# EasyEDA schematic metoutelete.json
TITLE: Metoutelete; REV: 1.0; Date: 2024-10-17; Sheet: 1/1; Company: Your Company
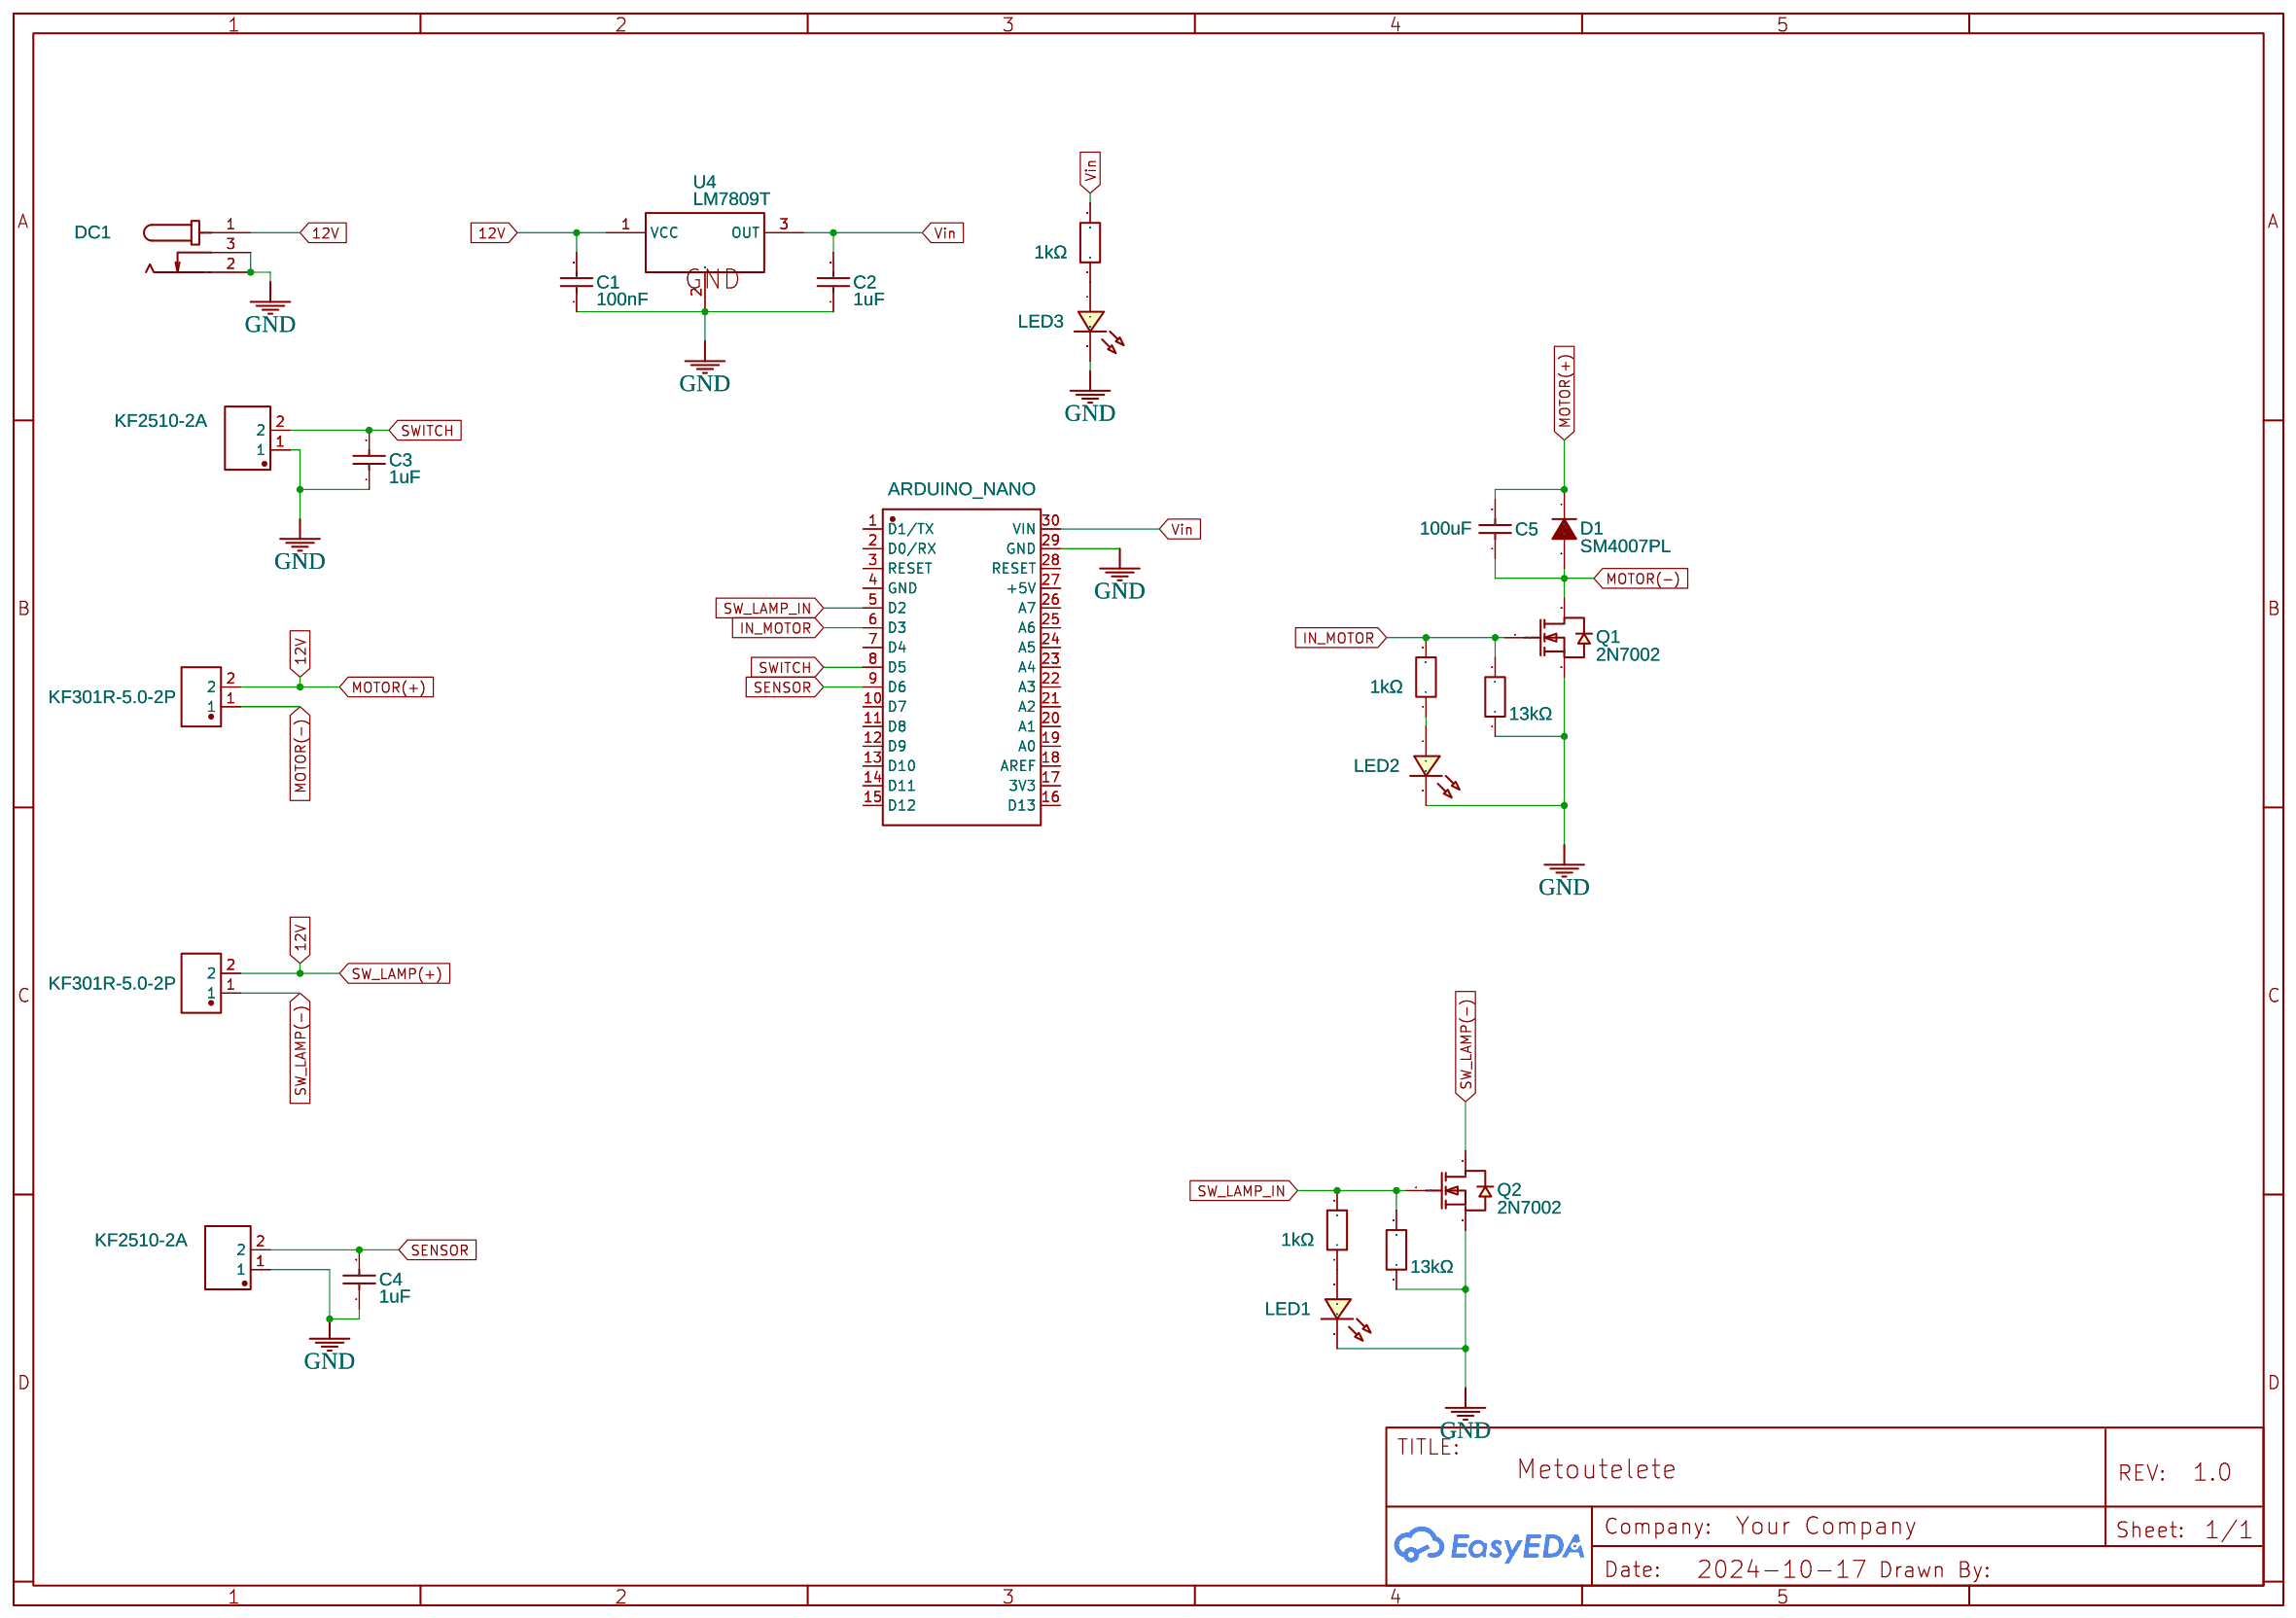
[diagram p0: schematic sheet]

## Parts
C1  100nF  [C0201]
C2  1uF  [C0603]
C3  1uF  [C0603]
C4  1uF  [C0603]
C5  100uF  [C0201]
CN1  KF2510-2A  [CONN-TH_KF2510-2A]
CN2  KF2510-2A  [CONN-TH_KF2510-2A]
D1  SM4007PL  [SOD-123F_L2.8-W1.8-LS3.7-RD]
DC1  DC-005-5A-2.0-SMT  [DC-IN-TH_DC-005-5A-2.0-SMT]
LED1  LED-0603_R  [LED0603_RED]
LED2  LED-0603_R  [LED0603_RED]
LED3  LED-0603_R  [LED0603_RED]
Q1  2N7002  [SOT-23-3_L2.9-W1.3-P1.90-LS2.4-BR]
Q2  2N7002  [SOT-23-3_L2.9-W1.3-P1.90-LS2.4-BR]
U1  ARDUINO_NANO  [COMM-TH_ARDUINO_NANO]
U2  13kΩ  [R0603]
U3  13kΩ  [R0603]
U4  LM7809T  [TO-220-3_L10.0-W4.5-P2.54-L]
U5  KF301R-5.0-2P  [CONN-TH_P5.00_KF301R-5.0-2P]
U6  KF301R-5.0-2P  [CONN-TH_P5.00_KF301R-5.0-2P]
U7  1kΩ  [R0603]
U8  1kΩ  [R0603]
U9  1kΩ  [R0603]

## Library data of the parts
C1 C5 = 0201X104K6R3NT: Supplier: LCSC; Manufacturer: FH(风华); Supplier Part: C66938; JLCPCB Part Class: Extended Part
C2-C4 = 0603B474K500NT: Supplier: LCSC; Manufacturer: FH(风华); Supplier Part: C77572; JLCPCB Part Class: Extended Part
CN1 CN2 = KF2510-2A: Supplier: LCSC; Manufacturer Part: 2510-2A; Manufacturer: BOOMELE(博穆精密); Supplier Part: C27543; JLCPCB Part Class: Extended Part
D1 = SM4007PL: Supplier: LCSC; Manufacturer: MDD(辰达半导体); Supplier Part: C64898; JLCPCB Part Class: Basic Part
DC1 = DC-005-5A-2.0-SMT: Contributor: LCSC; Supplier: LCSC; Supplier Part: C319134; Manufacturer: XKB Connection(中国星坤); JLCPCB Part Class: Extended Part
LED1-LED3 = LED-0603_R: Manufacturer: EVERLIGHT(台湾亿光); Manufacturer Part: 19-217/R6C-AL1M2VY/3T; Supplier Part: C72044; Supplier: LCSC; Contributor: LCEDA_01
Q1 Q2 = 2N7002: Supplier: LCSC; Manufacturer: CJ(江苏长电/长晶); Supplier Part: C8545; JLCPCB Part Class: Basic Part
U1 = ARDUINO_NANO: Contributor: lcsc; Supplier: LCSC; Supplier Part: C9900017879; Manufacturer: null; JLCPCB Part Class: Extended Part
U2 U3 U7-U9 = 0603 ±5% 10K: Supplier: LCSC; Supplier Part: C2889392; Manufacturer: VO(翔胜); JLCPCB Part Class: Extended Part; Contributor: lcsc
U4 = LM7809T: Contributor: LCSC; Supplier: LCSC; Supplier Part: C507141; Manufacturer: HGSEMI(华冠); JLCPCB Part Class: Extended Part
U5 U6 = KF301R-5.0-2P: Contributor: LCSC; Supplier: LCSC; Supplier Part: C474883; Manufacturer: KEFA(科发); JLCPCB Part Class: Extended Part

## Nets
12V: C1.2 C5.2 D1.1(C) DC1.1 U4.1(VCC) U5.2 U6.2
GND: C1.1 C2.1 C3.1 C4.1 CN1.1 CN2.1 DC1.2 DC1.3 LED1.2 LED2.2 LED3.2 Q1.2(S) Q2.2(S) U1.29(GND) U2.1 U3.1 U4.2(GND)
Vin: C2.2 U1.30(VIN) U4.3(OUT) U9.2
IN_MOTOR: Q1.1(G) U1.6(D3) U3.2 U8.2
MOTOR(-): C5.1 D1.2(A) Q1.3(D) U5.1
SENSOR: C4.2 CN2.2 U1.9(D6)
SW_LAMP(-): Q2.3(D) U6.1
SW_LAMP_IN: Q2.1(G) U1.5(D2) U2.2 U7.2
SWITCH: C3.2 CN1.2 U1.8(D5)
Net-(LED1-1): LED1.1 U7.1
Net-(LED2-1): LED2.1 U8.1
Net-(LED3-1): LED3.1 U9.1

Not connected (* = marked no-connect by the designer): U1 1(D1/TX) 2(D0/RX) 3(RESET) 4(GND) 7(D4) 10(D7) 11(D8) 12(D9) 13(D10) 14(D11) 15(D12) 16(D13) 17(3V3) 18(AREF) 19(A0) 20(A1) 21(A2) 22(A3) 23(A4) 24(A5) 25(A6) 26(A7) 27(+5V) 28(RESET)
